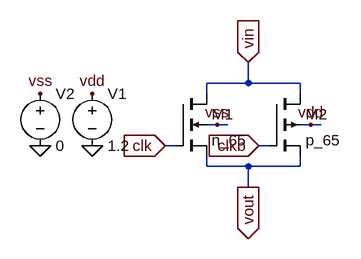
[diagram p0: schematic TG_Switch.asc]
TG_Switch.asc, the LTspice schematic file:
Version 4.1
SHEET 1 880 680
WIRE 112 0 112 -32
WIRE 112 0 48 0
WIRE 192 0 112 0
WIRE 48 16 48 0
WIRE 192 16 192 0
WIRE 64 64 48 64
WIRE 80 64 64 64
WIRE 208 64 192 64
WIRE 224 64 208 64
WIRE 0 96 -16 96
WIRE 144 96 128 96
WIRE 48 128 48 112
WIRE 112 128 48 128
WIRE 192 128 192 112
WIRE 192 128 112 128
WIRE 112 160 112 128
FLAG 64 64 vss
FLAG 208 64 vdd
FLAG -16 96 clk
IOPIN -16 96 In
FLAG 128 96 clkb
IOPIN 128 96 In
FLAG 112 -32 vin
IOPIN 112 -32 In
FLAG -128 96 0
FLAG -128 16 vdd
FLAG -208 96 0
FLAG -208 16 vss
FLAG 112 160 vout
IOPIN 112 160 Out
SYMBOL nmos4 0 16 R0
SYMATTR InstName M1
SYMATTR Value n_65
SYMATTR Value2 l=1u w=1u
SYMBOL pmos4 144 16 R0
SYMATTR InstName M2
SYMATTR Value p_65
SYMATTR Value2 l=1u w=2u
SYMBOL voltage -128 0 R0
WINDOW 123 0 0 Left 0
WINDOW 39 0 0 Left 0
SYMATTR InstName V1
SYMATTR Value 1.2
SYMBOL voltage -208 0 R0
WINDOW 123 0 0 Left 0
WINDOW 39 0 0 Left 0
SYMATTR InstName V2
SYMATTR Value 0

The netlist it stands for:
* TG_Switch.asc
M1 vin clk vout vss n_65 l=1u w=1u
M2 vin clkb vout vdd p_65 l=1u w=2u
V1 vdd 0 1.2
V2 vss 0 0
.model NMOS NMOS
.model PMOS PMOS
.lib standard.mos
.backanno
.end